# EAGLE design motion_sensor (EAGLE 6.5.0)
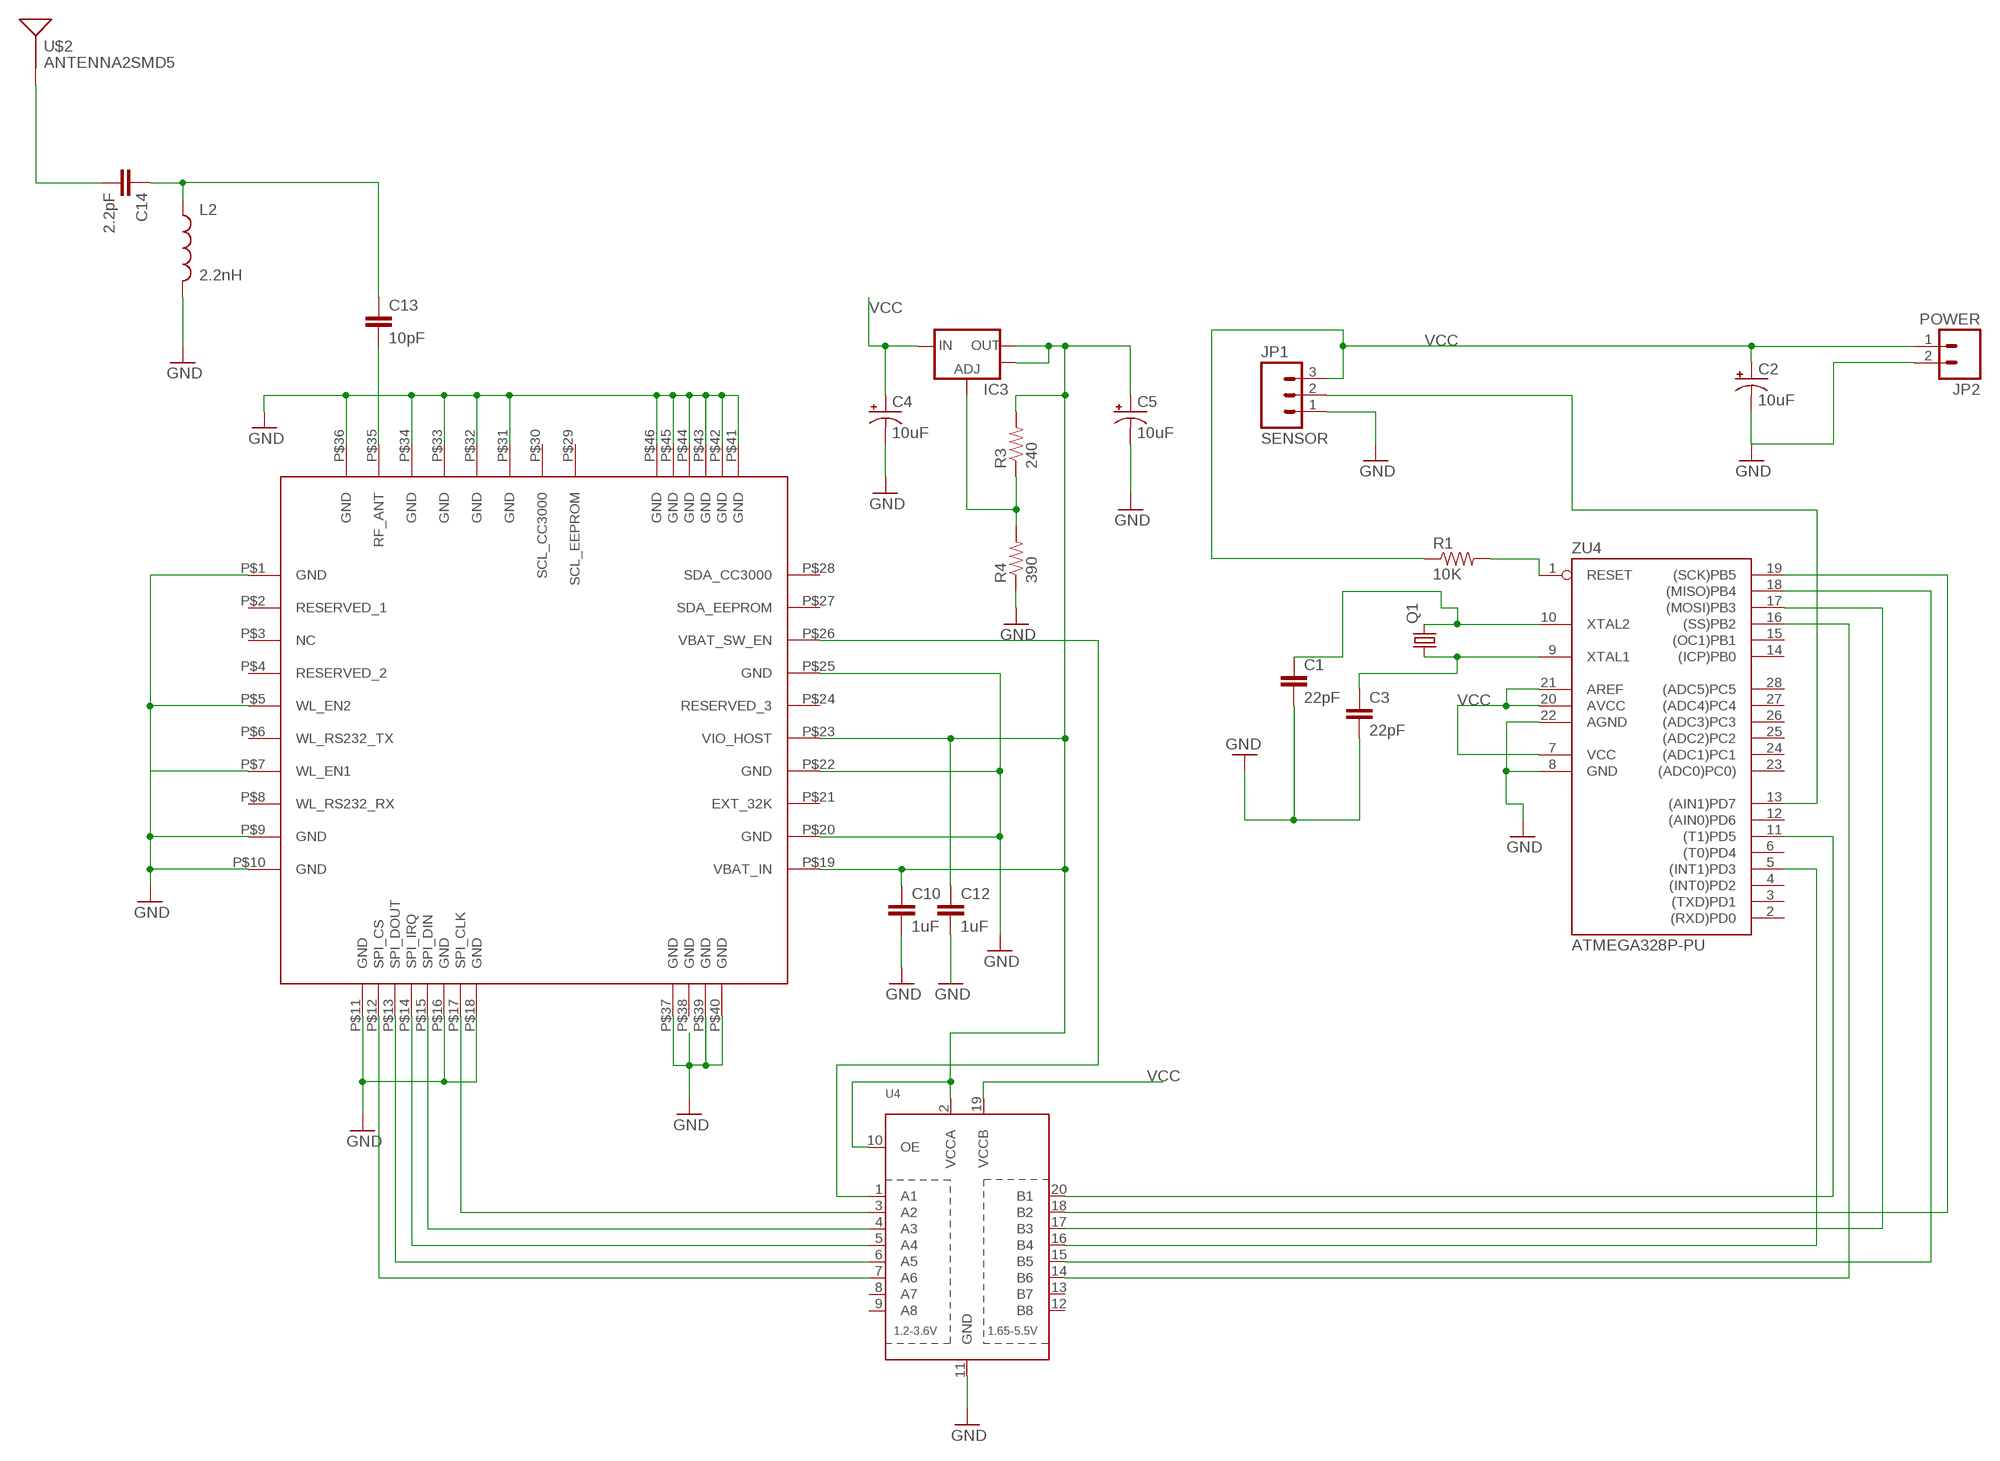
[diagram p0: schematic, sheet 1]

## Parts
C1  22pF  CAP0805  [0805]
C2  10uF  CAP_POL1206  [EIA3216]
C3  22pF  CAP0805  [0805]
C4  10uF  CAP_POL3528  [EIA3528]
C5  10uF  CAP_POL3528  [EIA3528]
C10  1uF  CAP1206  [1206]
C12  1uF  CAP1206  [1206]
C13  10pF  CAP0805  [0805]
C14  2.2pF  CAP0805  [0805]
IC3  V_REG_LM1117SOT223  [SOT223]
JP1  SENSOR  M03PTH  [1X03]
JP2  POWER  M02PTH  [1X02]
L2  2.2nH  INDUCTOR0805  [0805]
Q1  CRYSTALHC49U-V  [HC49U-V]
R1  10K  RESISTOR0805-RES  [0805]
R3  240  RESISTOR0805-RES  [0805]
R4  390  RESISTOR0805-RES  [0805]
U4  TXB0108PWR  [TSSOP20]
U$1  CC3000  [CC3000]
U$2  ANTENNA2SMD5  [ANTENNA-CHIP5]
ZU4  ATMEGA328P-PU  [DIL28-3]

## Nets
GND [gnd]: C1.2 C2.C(-) C3.2 C4.C(-) C5.C(-) C10.2 JP1.1 JP2.2 L2.2 R4.1 U4.11(GND) U$1.P$1(GND) U$1.P$5(WL_EN2) U$1.P$7(WL_EN1) U$1.P$9(GND) U$1.P$10(GND) U$1.P$11(GND) U$1.P$16(GND) U$1.P$18(GND) U$1.P$20(GND) U$1.P$22(GND) U$1.P$25(GND) U$1.P$31(GND) U$1.P$32(GND) U$1.P$33(GND) U$1.P$34(GND) U$1.P$36(GND) U$1.P$37(GND) U$1.P$39(GND) U$1.P$40(GND) U$1.P$41(GND) U$1.P$42(GND) U$1.P$43(GND) U$1.P$44(GND) U$1.P$45(GND) U$1.P$46(GND) ZU4.8(GND) ZU4.22(AGND)
N$1: U4.20(B1) ZU4.11((T1)PD5)
N$2: U4.16(B4) ZU4.5((INT1)PD3)
N$3: R1.2 ZU4.1(RESET)
N$4: C3.1 Q1.1 ZU4.9(XTAL1)
N$5: U4.18(B2) ZU4.19((SCK)PB5)
N$6: U4.14(B6) ZU4.16((SS)PB2)
N$7: C12.2
N$8: C5.A(+) C10.1 C12.1 IC3.2(OUT) IC3.4(OUT) R3.2 U4.2(VCCA) U4.10(OE) U$1.P$19(VBAT_IN) U$1.P$23(VIO_HOST)
N$9: U4.7(A6) U$1.P$12(SPI_CS)
N$10: U4.6(A5) U$1.P$13(SPI_DOUT)
N$11: U4.5(A4) U$1.P$14(SPI_IRQ)
N$12: U4.4(A3) U$1.P$15(SPI_DIN)
N$13: U4.3(A2) U$1.P$17(SPI_CLK)
N$14: U4.1(A1) U$1.P$26(VBAT_SW_EN)
N$15: IC3.1(ADJ) R3.1 R4.2
N$16: C13.2 U$1.P$35(RF_ANT)
N$17: C13.1 C14.1 L2.1
N$18: C14.2 U$2.FEED(SIGNAL)
N$19: U4.15(B5) ZU4.18((MISO)PB4)
N$20: U4.17(B3) ZU4.17((MOSI)PB3)
N$26: JP1.2 ZU4.13((AIN1)PD7)
VCC [usbvcc]: C2.A(+) C4.A(+) IC3.3(IN) JP1.3 JP2.1 R1.1 U4.19(VCCB) ZU4.7(VCC) ZU4.20(AVCC) ZU4.21(AREF)
XTAL2: C1.1 Q1.2 ZU4.10(XTAL2)
Unconnected: U4.8(A7) U4.9(A8) U4.12(B8) U4.13(B7) U$1.P$2(RESERVED_1) U$1.P$3(NC) U$1.P$4(RESERVED_2) U$1.P$6(WL_RS232_TX) U$1.P$8(WL_RS232_RX) U$1.P$21(EXT_32K) U$1.P$24(RESERVED_3) U$1.P$27(SDA_EEPROM) U$1.P$28(SDA_CC3000) U$1.P$38(GND) ZU4.2((RXD)PD0) ZU4.3((TXD)PD1) ZU4.4((INT0)PD2) ZU4.6((T0)PD4) ZU4.12((AIN0)PD6) ZU4.14((ICP)PB0) ZU4.15((OC1)PB1) ZU4.23((ADC0)PC0)) ZU4.24((ADC1)PC1) ZU4.25((ADC2)PC2) ZU4.26((ADC3)PC3) ZU4.27((ADC4)PC4) ZU4.28((ADC5)PC5)

## Power pins joined to a net without a drawn wire
SCL_CC3000: U$1.P$30(SCL_CC3000)
SCL_EEPROM: U$1.P$29(SCL_EEPROM)

## Library data of the parts
C1 C3 = SparkFun-Passives:CAP: Capacitor Standard 0603 ceramic capacitor, and 0.1" leaded capacitor.
C2 C4 C5 = SparkFun-Passives:CAP_POL: Capacitor Polarized These are standard SMD and PTH capacitors. Normally 10uF, 47uF, and 100uF in electrolytic and tantalum varieties. Always verify the external diameter of the through hole cap, it varies with capacity, voltage, and manufacturer. The EIA devices should be standard.
C10 C12-C14 = SparkFun-Capacitors:CAP: Capacitor Standard 0603 ceramic capacitor, and 0.1" leaded capacitor.
IC3 = SparkFun-PowerIC:V_REG_LM1117: Voltage Regulator LM1117 Standard adjustable voltage regulator but in SMD form. Spark Fun Electronics SKU : COM-00595
JP1 = SparkFun-Connectors:M03: Header 3 Standard 3-pin 0.1" header. Use with straight break away headers (SKU : PRT-00116), right angle break away headers (PRT-00553), swiss pins (PRT-00743), machine pins (PRT-00117), and female headers (PRT-00115). Molex polarized connector foot print use with SKU : PRT-08232 with associated crimp pins and housings.
JP2 = SparkFun-Connectors:M02: Standard 2-pin 0.1" header. Use with - straight break away headers ( PRT-00116) - right angle break away headers (PRT-00553) - swiss pins (PRT-00743) - machine pins (PRT-00117) - female headers (PRT-00115) Molex polarized connector foot print use with: PRT-08233 with associated crimp pins and housings. 2.54_SCREWTERM for use with PRT-10571. 3.5mm Screw Terminal footprints for PRT-08084 5mm Screw Terminal footprints for use with PRT-08433
L2 = SparkFun-Passives:INDUCTOR: Inductors Basic Inductor/Choke - 0603 and 1206. Footprints are not proven and vary greatly between part numbers. SRN6045- 33uH, 20% 1.4A
Q1 = adafruit:CRYSTAL: CRYSTAL; OC_FARNELL: 1666969; OC_NEWARK: unknown
R1 = SparkFun-Passives:RESISTOR: Resistor Basic schematic elements and footprints for 0603, 1206, and PTH resistors.
R3 R4 = SparkFun-Resistors:RESISTOR: Resistor Basic schematic elements and footprints for 0603, 1206, and PTH resistors.
U4 = adafruit:TXB0108PWR: 8-Bit Bi-Directional Level Shifter 1.2V-3.6V (VCCA) to 1.65V-5.5V (VCCB) bi-directional level shifter with auto direction sensing. Max data rate - VCCA 1.8V: 20Mbps (50ns), VCCA 3.3V: 100Mbps (10ns) Digikey: 296-21527-1-ND
U$1 = centerblack_engineering:CC3000: TI SimpleLink CC3000 Module - WiFi 802.11b/g Network Processor; AUTHOR: Matt Bigarani; DATASHEET: http://www.ti.com/lit/ds/symlink/cc3000.pdf; DATE: 2/8/2013
U$2 = SparkFun-RF-Modified:ANTENNA2: Chip antenna Single endded antenna. Common with smaller chip antennas. CHIP4 package is the GPS Chip Antenna SKU: GPS-08418. CHIP5 package is 2.4GHz chip antenna SKU: WRL-00144.
ZU4 = SmartPrj:ATMEGA328P-: MICROCONTROLLER 4 Kbytes FLASH 128 bytes SRAM 256 bytes EEPROM UART 6-channel 10 bit ADC

## Net classes
0 default: width 0.152 mm, clearance 0.152 mm
1 power: width 0.61 mm, drill 0.61 mm, clearance 0.254 mm
2 gnd: width 0.203 mm, drill 0.559 mm, clearance 0.152 mm
3 usbvcc: width 0.203 mm, drill 0.61 mm, clearance 0.152 mm
4 aref: width 0.406 mm, drill 0.61 mm, clearance 0.254 mm

## Board
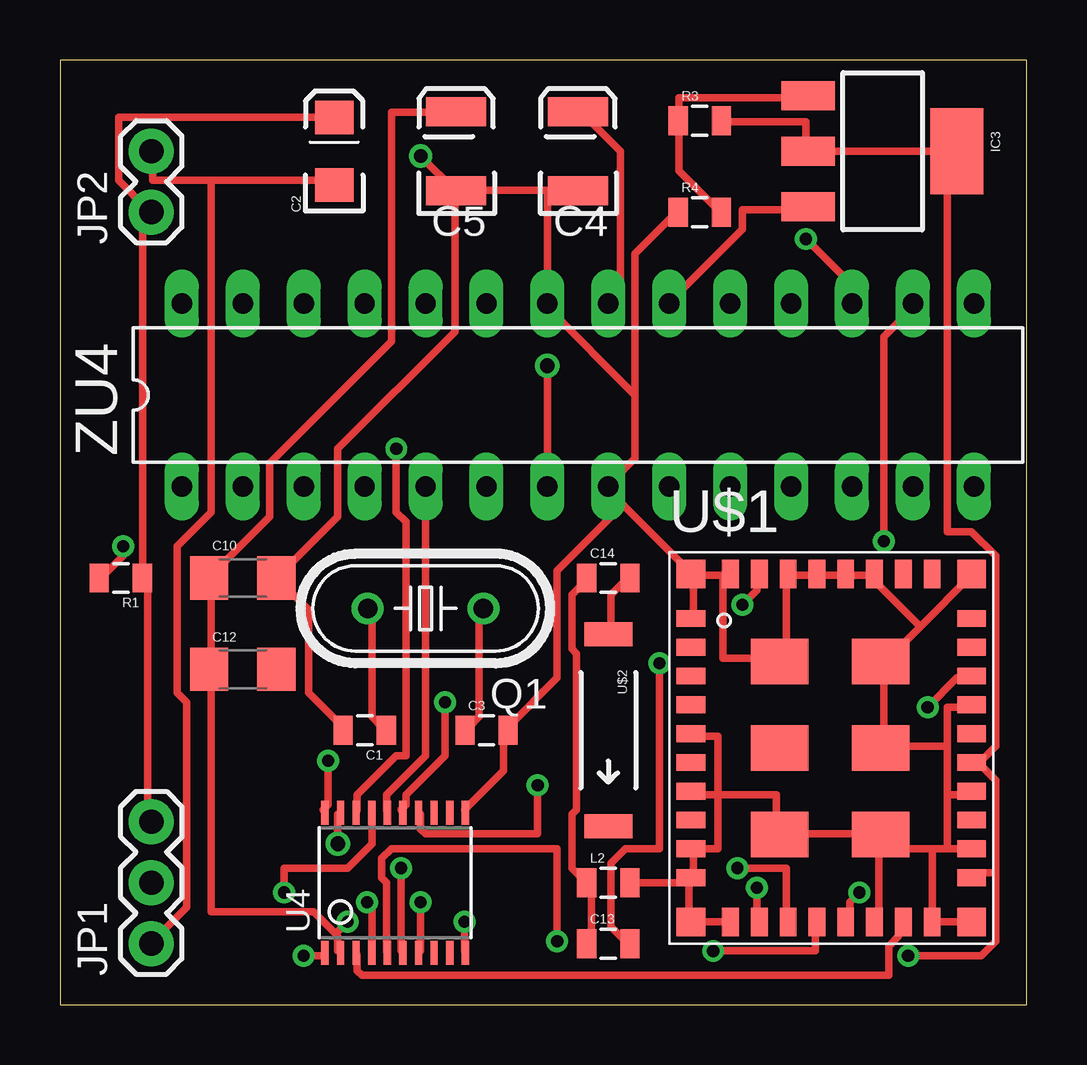
[diagram p1: board, top side]
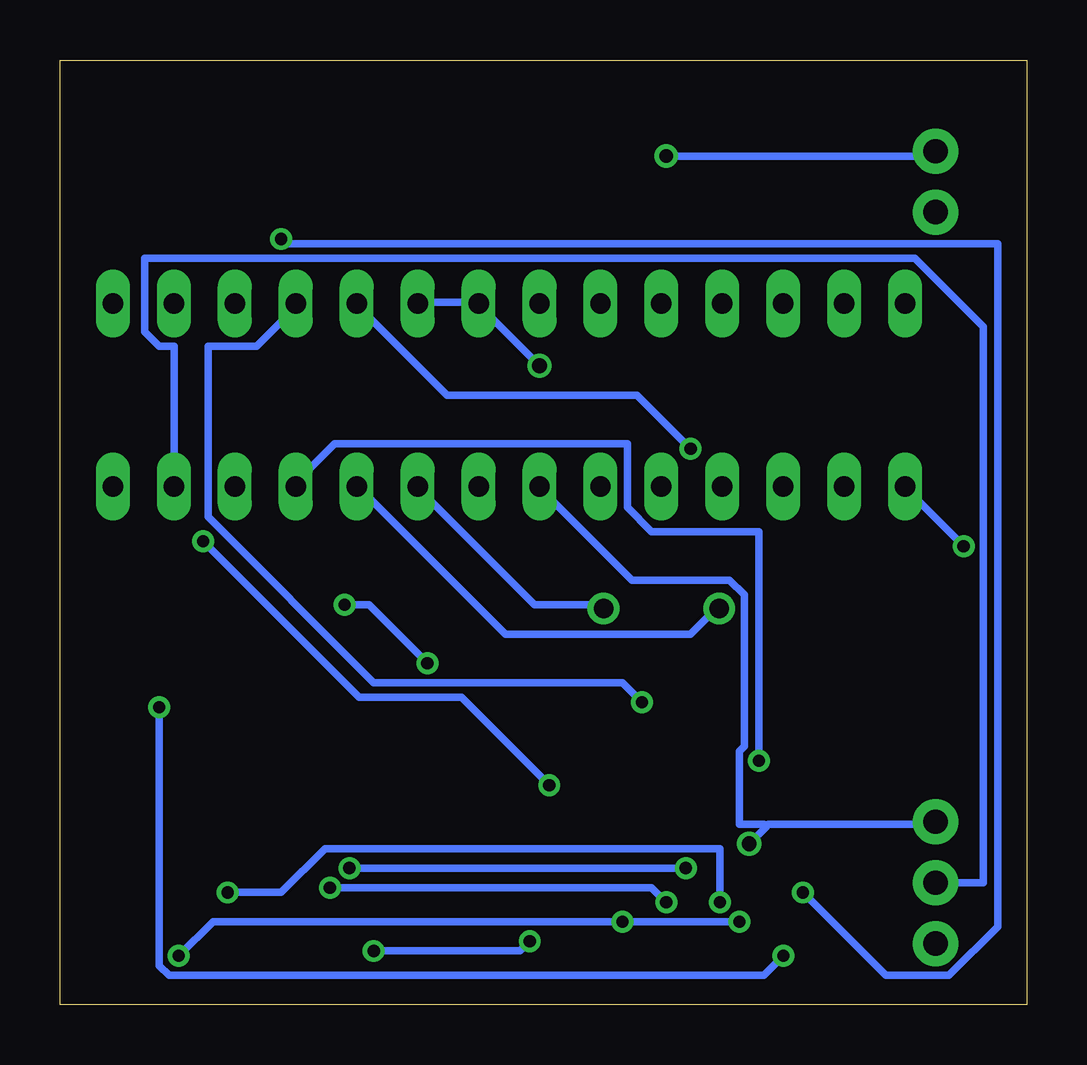
[diagram p2: board, bottom side, seen from below]

Size 40.31 x 39.36 mm. Coordinates in mm from the lower left corner, seen from the top.
Outline: 0,0 40.31,0 40.31,39.36 0,39.36 0,0
Copper layers (1*16): Top 0.035mm / dielectric 1.5mm / Bottom 0.035mm
Design rules "default *": minimum track width 12mil, minimum drill 20mil, track to track 8mil, track to pad 8mil, pad to pad 8mil, via to via 8mil, smd to smd 8mil, copper to edge 40mil, drill to drill 8mil, minimum pad ring 10mil, minimum via ring 8mil, stop-mask expansion 4mil, vias tented up to drill 0mil, thermal gap 10mil

### Footprints (pad centres in the part's own frame; a part is rotated, then mirrored left to right if it is on the bottom)
0805 = smd 0.8 x 1.2: 1 -0.9,0; 2 0.9,0
EIA3216 = smd 1.4 x 1.6: A 1.4,0; C -1.4,0
EIA3528 = smd 1.2 x 2.5: A 1.65,0; C -1.65,0
1206 = smd 1.6 x 1.8: 1 -1.4,0; 2 1.4,0
SOT223 = smd 1.219 x 2.235: 1 -2.311,-3.099; 2 0,-3.099; 3 2.311,-3.099 | smd 3.6 x 2.2: 4 0,3.099
1X03 = drill 1.016 pad 1.88: 1 0,0; 2 2.54,0; 3 5.08,0
1X02 = drill 1.016 pad 1.88: 1 0,0; 2 2.54,0
HC49U-V = drill 0.813: 1 -2.413,0; 2 2.413,0
TSSOP20 = smd 0.305 x 0.991: 1 -2.925,-2.918; 2 -2.275,-2.918; 3 -1.625,-2.918; 4 -0.975,-2.918; 5 -0.325,-2.918; 6 0.325,-2.918; 7 0.975,-2.918; 8 1.625,-2.918; 9 2.275,-2.918; 10 2.925,-2.918; 11 2.925,2.918; 12 2.275,2.918; 13 1.625,2.918; 14 0.975,2.918; 15 0.325,2.918; 16 -0.325,2.918; 17 -0.975,2.918; 18 -1.625,2.918; 19 -2.275,2.918; 20 -2.925,2.918
CC3000 = smd 1.2 x 0.7: P$1 0.9,13.55; P$2 0.9,12.35; P$3 0.9,11.15; P$4 0.9,9.95; P$5 0.9,8.75; P$6 0.9,7.55; P$7 0.9,6.35; P$8 0.9,5.15; P$9 0.9,3.95; P$10 0.9,2.75; P$19 12.6,2.75; P$20 12.6,3.95; P$21 12.6,5.15; P$22 12.6,6.35; P$23 12.6,7.55; P$24 12.6,8.75; P$25 12.6,9.95; P$26 12.6,11.15; P$27 12.6,12.35; P$28 12.6,13.55 | smd 0.7 x 1.2: P$11 2.55,0.9; P$12 3.75,0.9; P$13 4.95,0.9; P$14 6.15,0.9; P$15 7.35,0.9; P$16 8.55,0.9; P$17 9.75,0.9; P$18 10.95,0.9; P$29 10.95,15.4; P$30 9.75,15.4; P$31 8.55,15.4; P$32 7.35,15.4; P$33 6.15,15.4; P$34 4.95,15.4; P$35 3.75,15.4; P$36 2.55,15.4 | smd 2.4 x 1.9: P$37 4.6,11.75; P$38 4.6,8.15; P$39 4.6,4.55; P$40 8.8,11.75; P$41 8.8,8.15; P$42 8.8,4.55 | smd 1.2 x 1.2: P$43 0.9,15.4; P$44 0.9,0.9; P$45 12.6,0.9; P$46 12.6,15.4
ANTENNA-CHIP5 = smd 1 x 2: FEED -4,0; NC 4,0
DIL28-3 = drill 0.85 pad 1.422 long: 1 -16.51,-3.81; 2 -13.97,-3.81; 3 -11.43,-3.81; 4 -8.89,-3.81; 5 -6.35,-3.81; 6 -3.81,-3.81; 7 -1.27,-3.81; 8 1.27,-3.81; 9 3.81,-3.81; 10 6.35,-3.81; 11 8.89,-3.81; 12 11.43,-3.81; 13 13.97,-3.81; 14 16.51,-3.81; 15 16.51,3.81; 16 13.97,3.81; 17 11.43,3.81; 18 8.89,3.81; 19 6.35,3.81; 20 3.81,3.81; 21 1.27,3.81; 22 -1.27,3.81; 23 -3.81,3.81; 24 -6.35,3.81; 25 -8.89,3.81; 26 -11.43,3.81; 27 -13.97,3.81; 28 -16.51,3.81

### Placement (x,y rotation side)
C1  12.7,11.43 180 top
C2  11.43,35.56 90 top
C3  17.78,11.43 0 top
C4  21.59,35.56 90 top
C5  16.51,35.56 90 top
C10  7.62,17.78 0 top
C12  7.62,13.97 0 top
C13  22.86,2.54 0 top
C14  22.86,17.78 0 top
IC3  34.29,35.56 270 top
JP1  3.81,2.54 90 top
JP2  3.81,33.02 90 top
L2  22.86,5.08 0 top
Q1  15.24,16.51 180 top
R1  2.54,17.78 180 top
R3  26.67,36.83 0 top
R4  26.67,33.02 0 top
U4  13.97,5.08 0 top
U$1  25.4,2.54 0 top
U$2  22.86,11.43 270 top
ZU4  21.59,25.4 0 top

### Tracks (layer width: path | path; a pad name or v marks a point on that pad's centre or on a via)
GND  (via drill 0.56)
  Top 0.305: 6.3,34.34 3.86,34.34 3.86,35.56 JP2.2 | 6.3,34.34 11.38,34.34 C2.C | 6.3,34.34 6.3,20.52 4.88,19.1 4.88,13.01 5.28,12.6 5.28,4.06 3.86,2.64 JP1.1 | C1.2 11.79,11.58 10.36,13.01 10.36,16.46 9.14,17.68 C10.2 9.14,17.88 11.58,20.32 11.58,23.16 16.46,28.04 16.46,33.73 C5.C | 20.32,33.93 21.54,33.93 C4.C | 20.32,33.93 16.66,33.93 C5.C | 20.32,33.93 ZU4.22 20.32,29.06 23.98,25.4 | 28.04,3.45 U$1.P$11 27.84,3.45 26.42,3.45 U$1.P$44 26.21,3.45 26.21,5.08 | 26.21,5.08 L2.2 | 26.21,5.08 26.21,5.28 U$1.P$10 | 26.42,5.28 U$1.P$10 | U$1.P$10 26.42,5.49 26.42,6.3 U$1.P$9 26.42,6.5 27.43,6.5 27.43,8.74 | 26.21,5.08 U$1.P$10 | 27.43,8.74 29.87,8.74 29.87,7.11 U$1.P$39 30.07,7.11 34.14,7.11 U$1.P$42 | 27.43,8.74 26.42,8.74 U$1.P$7 | 27.43,8.74 27.43,11.18 26.42,11.18 U$1.P$5 | 34.34,14.22 35.87,15.75 | 35.87,15.75 38,17.88 U$1.P$46 | 34.34,14.43 U$1.P$40 34.34,14.22 | 35.87,15.75 34.14,17.48 34.14,17.88 U$1.P$31 33.93,17.88 32.92,17.88 U$1.P$32 32.72,17.88 31.7,17.88 U$1.P$33 31.5,17.88 30.48,17.88 U$1.P$34 30.28,17.88 30.28,14.63 30.07,14.43 U$1.P$37 29.87,14.43 27.64,14.43 27.64,17.88 | 36.37,3.45 38,3.45 U$1.P$45 | 33.93,3.45 U$1.P$16 34.14,3.45 34.14,6.5 | 34.14,6.5 34.14,6.91 U$1.P$42 | 34.14,6.5 36.37,6.5 | 36.37,6.5 36.98,6.5 | 36.98,6.5 38,6.5 U$1.P$20 | 34.14,6.5 U$1.P$42 | 36.98,8.74 38,8.74 U$1.P$22 | 36.98,6.5 36.98,8.74 | 36.98,8.74 36.98,10.77 | 36.98,10.77 36.98,12.39 38,12.39 U$1.P$25 | 36.37,6.5 36.37,3.45 | 36.37,3.45 U$1.P$18 | 34.34,7.11 U$1.P$42 | 36.98,10.77 34.34,10.77 | 34.34,10.77 34.34,14.22 | 34.34,10.77 U$1.P$41 | U4.11 16.87,8.13 18.49,9.75 18.49,11.38 C3.2 18.69,11.58 20.73,13.61 20.73,18.09 23.37,20.73 ZU4.8
  Top 0.305: 26.42,17.88 26.42,16.26 U$1.P$1 | 26.42,17.88 27.64,17.88 | 27.64,17.88 27.84,17.88 U$1.P$36 27.64,17.88 | 26.42,17.88 U$1.P$43 26.21,18.09 22.96,21.34 22.96,21.54 ZU4.8 | 23.98,25.4 23.98,22.76 22.96,21.74 ZU4.8 | 23.98,25.4 23.98,31.29 25.6,32.92 R4.1 | v15.04,35.36 16.46,33.93 C5.C
  Bottom 0.305: v15.04,35.36 4.06,35.36 3.86,35.56 JP2.2
N$1  (via drill 0.51)
  Top 0.305: v11.18,10.16 11.18,8.33 10.97,8.13 U4.20
  Bottom 0.305: v11.18,10.16 11.18,19.71 15.65,19.71 16.66,20.73 16.66,23.37 28.85,23.37 30.48,21.74 ZU4.11
N$2
  Top 0.305: ZU4.5 15.24,10.36 13.61,8.74 13.61,8.13 U4.16
N$3  (via drill 0.51)
  Top 0.305: v2.64,19.1 2.64,18.69 1.83,17.88 R1.2
  Bottom 0.305: v2.64,19.1 5.08,21.54 ZU4.1
N$4
  Top 0.305: C3.1 17.07,11.58 17.48,11.99 17.48,16.46 Q1.1
  Bottom 0.305: ZU4.9 25.4,21.54 20.52,16.66 17.68,16.66 Q1.1
N$5  (via drill 0.51)
  Top 0.305: v14.02,23.16 14.02,20.52 14.43,20.12 14.43,10.36 14.02,10.36 12.39,8.74 12.39,8.13 U4.18
  Bottom 0.305: v14.02,23.16 16.26,25.4 24.18,25.4 27.84,29.06 ZU4.19
N$6  (via drill 0.51)
  Top 0.305: v19.91,9.14 19.91,7.11 15.24,7.11 15.04,7.31 15.04,7.92 U4.14 | v34.34,19.3 34.34,27.84 35.56,29.06 ZU4.16
  Bottom 0.305: v19.91,9.14 23.57,12.8 27.84,12.8 v34.34,19.3
N$8  (via drill 0.51)
  Top 0.305: R3.2 27.64,36.78 31.09,36.78 31.09,35.56 IC3.2 IC3.4 | 39.01,5.49 38.2,5.49 U$1.P$19 | 39.01,5.49 39.01,9.35 38.2,10.16 U$1.P$23 38.41,10.16 39.01,10.77 39.01,18.69 38,19.71 36.98,19.71 36.98,35.15 IC3.4 | IC3.4 | 11.48,2.95 10.57,3.86 6.3,3.86 6.3,13.82 C12.1 6.3,14.02 6.3,17.68 C10.1 6.3,17.88 8.74,20.32 8.74,22.55 13.82,27.64 13.82,37.19 16.46,37.19 C5.A | 11.48,2.95 11.58,2.84 11.58,2.23 U4.2 | v16.87,3.45 16.87,2.23 U4.10 | 11.48,2.95 v11.99,3.45 | 39.01,5.49 39.01,2.64 38.41,2.03 v35.36,2.03
  Bottom 0.305: v11.99,3.45 v16.87,3.45 33.93,3.45 v35.36,2.03
N$9  (via drill 0.51)
  Top 0.305: v15.04,4.27 15.04,2.23 U4.7 | v29.06,4.88 29.06,3.45 U$1.P$12
  Bottom 0.305: v15.04,4.27 15.65,4.88 v29.06,4.88
N$10  (via drill 0.51)
  Top 0.305: v14.22,5.69 14.22,2.23 U4.6 | v28.25,5.69 30.28,5.69 30.28,3.45 U$1.P$13
  Bottom 0.305: v28.25,5.69 v14.22,5.69
N$11  (via drill 0.51)
  Top 0.305: v20.73,2.64 20.73,6.5 13.82,6.5 13.41,6.1 13.41,5.28 13.61,5.08 13.61,2.23 U4.5 | v27.23,2.23 31.5,2.23 31.5,3.25 U$1.P$14
  Bottom 0.305: v20.73,2.64 21.13,2.23 v27.23,2.23
N$12  (via drill 0.51)
  Top 0.305: v12.8,4.27 13.01,4.06 13.01,2.23 U4.4 | v33.33,4.67 32.92,4.27 32.92,3.45 U$1.P$15
  Bottom 0.305: v12.8,4.27 12.8,6.5 29.26,6.5 31.09,4.67 v33.33,4.67
N$13
  Top 0.305: U4.3 12.39,2.03 12.39,1.42 12.6,1.22 34.54,1.22 34.54,2.44 34.95,2.84 34.95,3.25 U$1.P$17
N$14  (via drill 0.51)
  Top 0.305: v10.16,2.03 10.97,2.03 U4.1 | v36.17,12.39 37.39,13.61 38,13.61 U$1.P$26
  Bottom 0.305: v10.16,2.03 10.97,1.22 35.76,1.22 36.17,1.63 v36.17,12.39
N$15
  Top 0.305: R4.2 27.43,33.12 25.81,34.75 25.81,36.78 R3.1 25.81,36.98 25.81,37.8 31.09,37.8 IC3.1
N$16  (via drill 0.51)
  Top 0.305: v24.99,14.22 24.99,6.5 23.57,6.5 22.96,5.89 22.96,3.25 23.57,2.64 C13.2 | v28.45,16.66 29.06,17.27 29.06,17.88 U$1.P$35
  Bottom 0.305: v24.99,14.22 27.43,16.66 v28.45,16.66
N$17
  Top 0.305: C13.1 22.15,2.64 22.15,5.08 L2.1 21.95,5.08 21.34,5.69 21.34,7.92 21.54,8.13 21.54,14.63 21.34,14.83 21.34,17.07 21.95,17.68 C14.1
N$18
  Top 0.305: C14.2 23.57,17.68 22.96,17.07 22.96,15.44 U$2.FEED
N$19  (via drill 0.51)
  Top 0.305: v16.05,12.6 16.05,10.36 14.43,8.74 14.43,8.33 14.22,8.13 U4.15
  Bottom 0.305: v16.05,12.6 16.87,13.41 27.23,13.41 34.14,20.32 34.14,27.43 32.11,27.43 30.48,29.06 ZU4.18
N$20  (via drill 0.51)
  Top 0.305: v9.35,4.67 9.35,5.69 11.99,5.69 13.01,6.71 13.01,7.92 U4.17 | v31.09,31.9 32.92,30.07 32.92,29.26 ZU4.17
  Bottom 0.305: v9.35,4.67 5.89,1.22 3.25,1.22 1.22,3.25 1.22,31.7 30.89,31.7 v31.09,31.9
N$26
  Bottom 0.305: ZU4.13 35.56,27.43 36.17,27.43 36.78,28.04 36.78,31.09 4.67,31.09 1.83,28.25 1.83,5.08 JP1.2
VCC  (via drill 0.61)
  Top 0.305: C4.A 21.74,37.19 23.37,35.56 23.37,29.67 22.96,29.26 ZU4.21 | IC3.3 31.09,33.12 28.45,33.12 28.45,32.31 25.4,29.26 ZU4.20 | C2.A 11.38,36.98 2.44,36.98 2.44,34.34 3.66,33.12 JP2.1 3.66,32.92 3.45,32.72 3.45,17.88 R1.1 3.45,17.68 3.66,17.48 3.66,7.72 JP1.3 | v11.58,6.71 11.58,7.92 U4.19 | ZU4.7 v20.32,26.62
  Bottom 0.305: ZU4.20 25.4,29.26 22.96,29.26 ZU4.21 22.76,29.06 v20.32,26.62 | 10.87,7.42 10.77,7.52 3.86,7.52 JP1.3 | 10.87,7.42 v11.58,6.71 | ZU4.7 20.32,21.54 16.46,17.68 12.39,17.68 11.79,17.07 11.79,10.77 11.99,10.57 11.99,7.52 10.97,7.52 10.87,7.42
XTAL2
  Top 0.305: C1.1 13.41,11.58 13.01,11.99 13.01,16.46 Q1.2
  Bottom 0.305: ZU4.10 27.84,21.54 21.74,15.44 14.02,15.44 13.01,16.46 Q1.2